# EAGLE design SparkFun_AST-CAN485 (EAGLE 7.7.0)
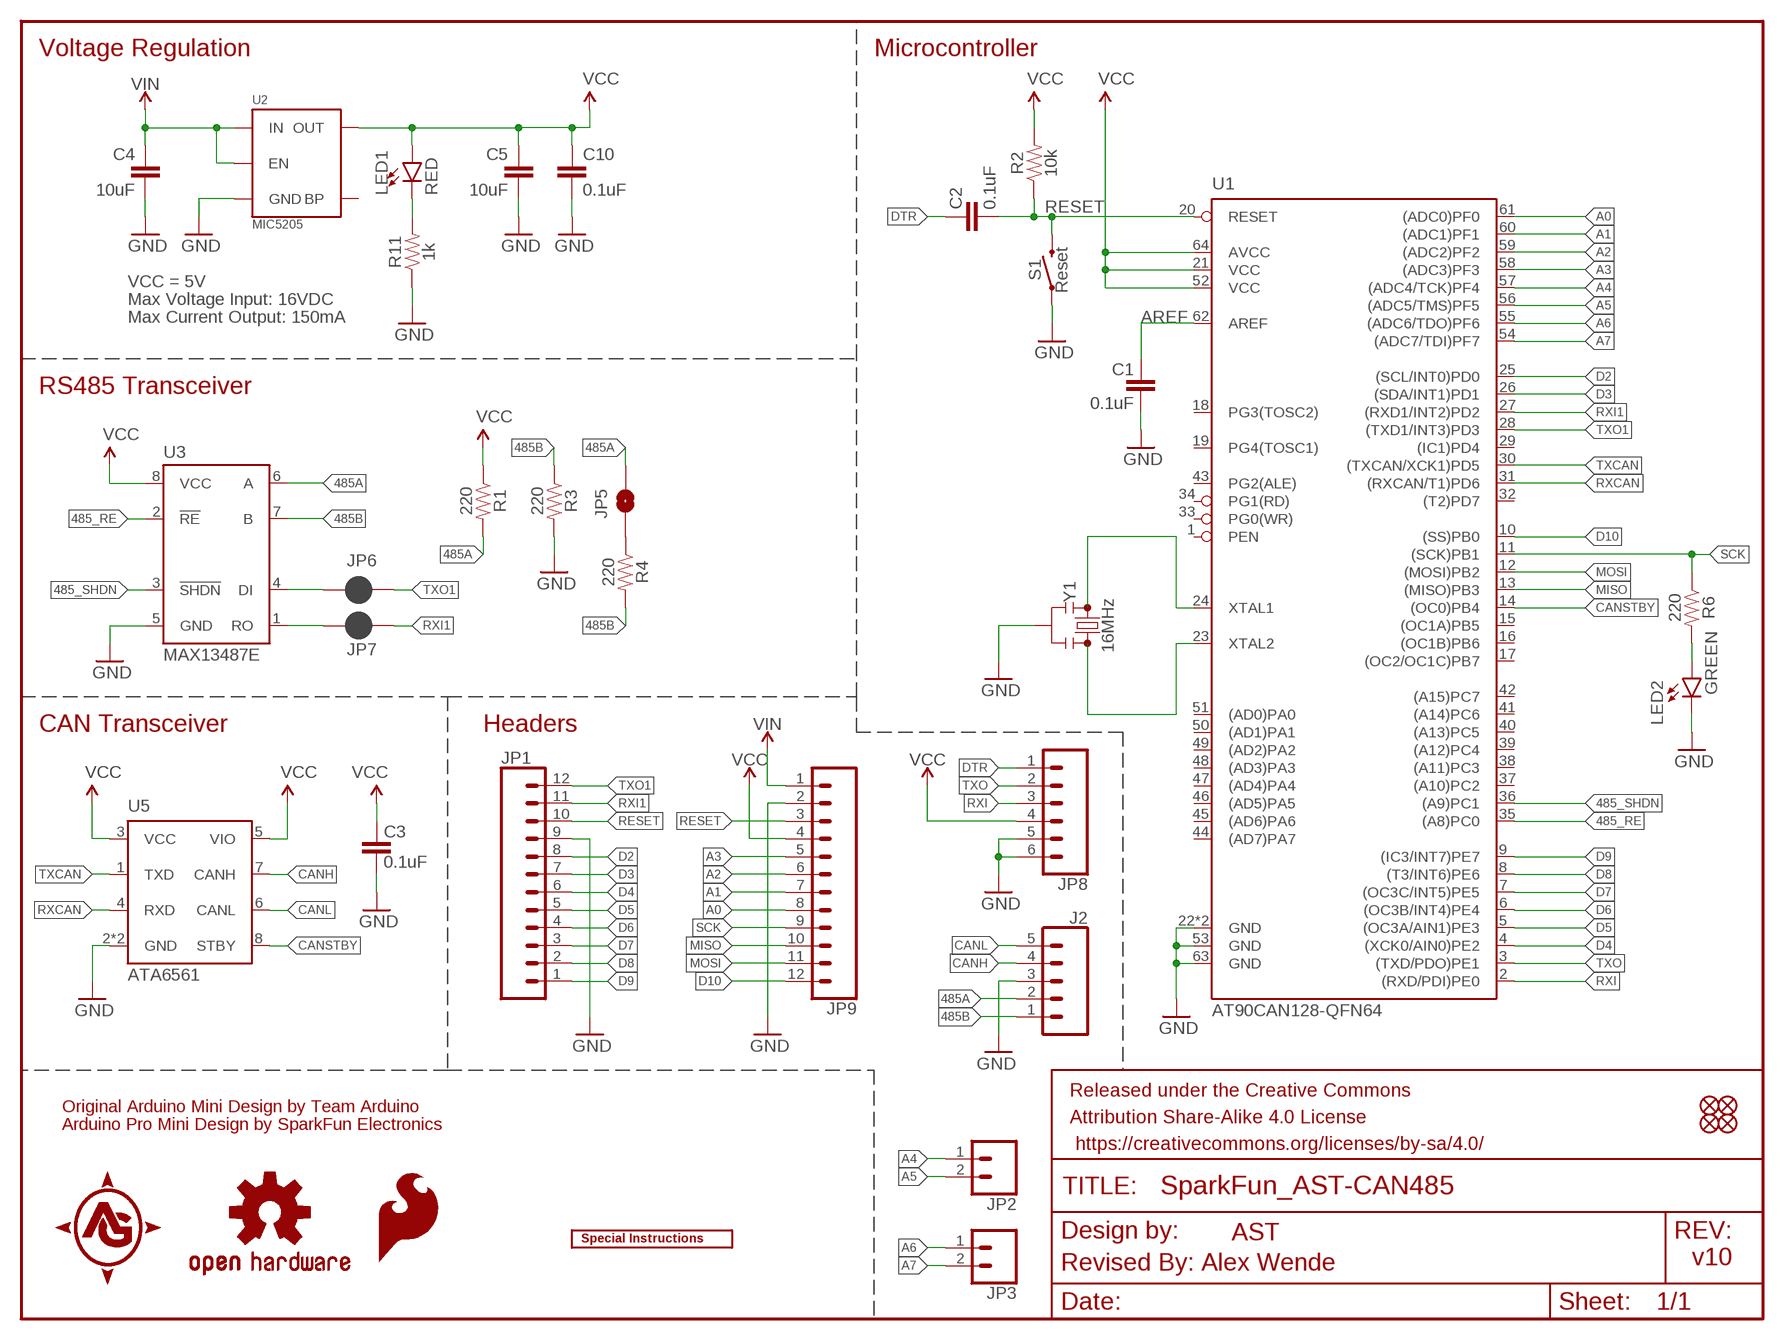
[diagram p0: schematic, sheet 1]

## Parts
C1  0.1uF  0.1UF-0402-16V-10%  [0402]
C2  0.1uF  0.1UF-0402-16V-10%  [0402]
C3  0.1uF  0.1UF-0402-16V-10%  [0402]
C4  10uF  10UF-1210-50V-20%  [1210]
C5  10uF  10UF-1210-50V-20%  [1210]
C10  0.1uF  0.1UF-0402-16V-10%  [0402]
FD1  FIDUCIALUFIDUCIAL  [FIDUCIAL-MICRO]
FD2  FIDUCIALUFIDUCIAL  [FIDUCIAL-MICRO]
FD3  FIDUCIALUFIDUCIAL  [FIDUCIAL-MICRO]
FD4  FIDUCIALUFIDUCIAL  [FIDUCIAL-MICRO]
FRAME1  FRAME-LETTER  [CREATIVE_COMMONS]
J2  CONN_05NO_SILK  [1X05_NO_SILK]
JP1  CONN_12NO_SILK  [1X12_NO_SILK]
JP2  CONN_021X02_NO_SILK  [1X02_NO_SILK]
JP3  CONN_021X02_NO_SILK  [1X02_NO_SILK]
JP5  JUMPER-PAD-2-NO  [PAD-JUMPER-2-NO_NO_SILK]
JP6  JUMPER-SMT_2_NC_PASTE_NO-SILK  [SMT-JUMPER_2_NC_PASTE_NO-SILK]
JP7  JUMPER-SMT_2_NC_PASTE_NO-SILK  [SMT-JUMPER_2_NC_PASTE_NO-SILK]
JP8  CONN_06NO_SILK_NO_POP  [1X06_NO_SILK]
JP9  CONN_12NO_SILK  [1X12_NO_SILK]
LED1  RED  LED-RED0603  [LED-0603]
LED2  GREEN  LED-GREEN0603  [LED-0603]
LOGO1  OSHW-LOGOMINI  [OSHW-LOGO-MINI]
LOGO2  SFE_LOGO_FLAME0.05_INCH  [SFE_LOGO_FLAME_.05]
R1  220  220OHM-0603-1/10W-1%  [0603]
R2  10k  10KOHM-0603-1/10W-1%  [0603]
R3  220  220OHM-0603-1/10W-1%  [0603]
R4  220  220OHM-0603-1/10W-1%  [0603]
R6  220  220OHM-0603-1/10W-1%  [0603]
R11  1k  1KOHM-0603-1/10W-1%  [0603]
S1  Reset  MOMENTARY-SWITCH-SPST-SMD-4.6X2.8MM  [TACTILE_SWITCH_SMD_4.6X2.8MM]
U1  AT90CAN128-QFN64  [QFN-64]
U2  MIC5205  [SOT23-5]
U3  MAX13487E  [SO08]
U5  ATA6561  [DFN8]
U$1  SPECIAL_INSTRUCTIONS-ORDERING  [ORDERING_INSTRUCTIONS]
Y1  16MHz  RESONATOR-16MHZSMD_3.2X1.3_SLIM  [RESONATOR-SMD-3.2X1.3(SLIM)]

## Nets
485_RE: U1.35((A8)PC0) U3.2(!RE)
485_SHDN: U1.36((A9)PC1) U3.3(!SHDN)
485A: J2.2 JP5.2 R1.2 U3.6(A)
485B: J2.1 R3.1 R4.2 U3.7(B)
A0: JP9.8 U1.61((ADC0)PF0)
A1: JP9.7 U1.60((ADC1)PF1)
A2: JP9.6 U1.59((ADC2)PF2)
A3: JP9.5 U1.58((ADC3)PF3)
A4: JP2.1 U1.57((ADC4/TCK)PF4)
A5: JP2.2 U1.56((ADC5/TMS)PF5)
A6: JP3.1 U1.55((ADC6/TDO)PF6)
A7: JP3.2 U1.54((ADC7/TDI)PF7)
AREF: C1.2 U1.62(AREF)
CANH: J2.4 U5.7(CANH)
CANL: J2.5 U5.6(CANL)
CANSTBY: U1.14((OC0)PB4) U5.8(STBY)
D2: JP1.8 U1.25((SCL/INT0)PD0)
D3: JP1.7 U1.26((SDA/INT1)PD1)
D4: JP1.6 U1.4((XCK0/AIN0)PE2)
D5: JP1.5 U1.5((OC3A/AIN1)PE3)
D6: JP1.4 U1.6((OC3B/INT4)PE4)
D7: JP1.3 U1.7((OC3C/INT5)PE5)
D8: JP1.2 U1.8((T3/INT6)PE6)
D9: JP1.1 U1.9((IC3/INT7)PE7)
D10: JP9.12 U1.10((SS)PB0)
DTR: C2.2 JP8.1
GND [vcc]: C1.1 C3.1 C4.2 C5.2 C10.2 J2.3 JP1.9 JP8.5 JP8.6 JP9.2 LED2.C R3.2 R11.1 S1.1 S1.2 U1.22(GND) U1.53(GND) U1.63(GND) U1.65(GND) U2.2(GND) U3.5(GND) U5.2(GND) U5.9(GND) Y1.2
MISO: JP9.10 U1.13((MISO)PB3)
MOSI: JP9.11 U1.12((MOSI)PB2)
N$1: U1.23(XTAL2) Y1.3
N$2: U1.24(XTAL1) Y1.1
N$3: JP5.1 R4.1
N$4: LED1.C R11.2
N$5: JP6.2 U3.4(DI)
N$6: JP7.2 U3.1(RO)
N$7: LED2.A R6.2
RESET: C2.1 JP1.10 JP9.3 R2.1 S1.3 S1.4 U1.20(RESET)
RXCAN: U1.31((RXCAN/T1)PD6) U5.4(RXD)
RXI: JP8.3 U1.2((RXD/PDI)PE0)
RXI1: JP1.11 JP7.1 U1.27((RXD1/INT2)PD2)
SCK: JP9.9 R6.1 U1.11((SCK)PB1)
TXCAN: U1.30((TXCAN/XCK1)PD5) U5.1(TXD)
TXO: JP8.2 U1.3((TXD/PDO)PE1)
TXO1: JP1.12 JP6.1 U1.28((TXD1/INT3)PD3)
VCC: C3.2 C5.1 C10.1 JP8.4 JP9.4 LED1.A R1.1 R2.2 U1.21(VCC) U1.52(VCC) U1.64(AVCC) U2.5(OUT) U3.8(VCC) U5.3(VCC) U5.5(VIO)
VIN [vcc]: C4.1 JP9.1 U2.1(IN) U2.3(EN)
Unconnected: U1.1(PEN) U1.15((OC1A)PB5) U1.16((OC1B)PB6) U1.17((OC2/OC1C)PB7) U1.18(PG3(TOSC2)) U1.19(PG4(TOSC1)) U1.29((IC1)PD4) U1.32((T2)PD7) U1.33(PG0(WR)) U1.34(PG1(RD)) U1.37((A10)PC2) U1.38((A11)PC3) U1.39((A12)PC4) U1.40((A13)PC5) U1.41((A14)PC6) U1.42((A15)PC7) U1.43(PG2(ALE)) U1.44((AD7)PA7) U1.45((AD6)PA6) U1.46((AD5)PA5) U1.47((AD4)PA4) U1.48((AD3)PA3) U1.49((AD2)PA2) U1.50((AD1)PA1) U1.51((AD0)PA0) U2.4(BP)

## Notes on the sheet
- Voltage Regulation | Microcontroller
- VCC = 5V
- Max Voltage Input: 16VDC
- Max Current Output: 150mA
- RS485 Transceiver
- CAN Transceiver | Headers
- Original Arduino Mini Design by Team Arduino
- Arduino Pro Mini Design by SparkFun Electronics
- AST
- Revised By: Alex Wende | v10

## Library data of the parts
C1-C3 C10 = SparkFun-Capacitors:0.1UF: 0.1µF ceramic capacitors A capacitor is a passive two-terminal electrical component used to store electrical energy temporarily in an electric field.; PROD_ID: CAP-12416
C4 C5 = SparkFun-Capacitors:10UF: 10.0µF ceramic capacitors A capacitor is a passive two-terminal electrical component used to store electrical energy temporarily in an electric field.; PROD_ID: CAP-09824
FD1-FD4 = SparkFun-Aesthetics:FIDUCIAL: Fiducial Alignment Points Point-of-reference for pick-and-place machines and other optical instruments.
FRAME1 = SparkFun-Aesthetics:FRAME-LETTER: Schematic Frame - Letter Standard 8.5x11 US Letter frame
J2 = SparkFun-Connectors:CONN_05: Multi connection point. Often used as Generic Header-pin footprint for 0.1 inch spaced/style header connections On any of the 0.1 inch spaced packages, you can populate with these: Break Away Headers - Straight <https://www.sparkfun.com/products/116> (PRT-00116) Break Away Male Headers - Right Angle <https://www.sparkfun.com/products/553> (PRT-00553) Female Headers <https://www.sparkfun.com/products/115> (PRT-00115) Break Away Headers - Machine Pin <https://www.sparkfun.com/products/117> (PRT-00117) Break Away Female Headers - Swiss Machine Pin <https://www.sparkfun.com/products/743> (PRT-00743) For SCREWTERMINALS and SPRING TERMINALS visit here: Screw Terimnals on SparkFun.com <https://www.sparkfun.com/search/results?term=Screw+Terminals> (5mm/3.5mm/2.54mm spacing) This device is also useful as a general connection point to wire up your design to another part of your project. Our various solder wires solder well into these plated through hole pads. Hook-Up Wire - Assortment (Stranded, 22 AWG) <https://www.sparkfun.com/products/11375> (PRT-11375) Hook-Up Wire - Assortment (Solid Core, 22 AWG) <https://www.sparkfun.com/products/11367> (PRT-11367) View the entire wire category on our website here <https://www.sparkfun.com/categories/141> Special notes: Molex polarized connector foot print use with SKU : PRT-08231 with associated crimp pins and housings. 1MM SMD Version SKU: PRT-10208
JP1 JP9 = SparkFun-Connectors:CONN_12: Multi connection point. Often used as Generic Header-pin footprint for 0.1 inch spaced/style header connections On any of the 0.1 inch spaced packages, you can populate with these: Break Away Headers - Straight <https://www.sparkfun.com/products/116> (PRT-00116) Break Away Male Headers - Right Angle <https://www.sparkfun.com/products/553> (PRT-00553) Female Headers <https://www.sparkfun.com/products/115> (PRT-00115) Break Away Headers - Machine Pin <https://www.sparkfun.com/products/117> (PRT-00117) Break Away Female Headers - Swiss Machine Pin <https://www.sparkfun.com/products/743> (PRT-00743) For SCREWTERMINALS and SPRING TERMINALS visit here: Screw Terimnals on SparkFun.com <https://www.sparkfun.com/search/results?term=Screw+Terminals> (5mm/3.5mm/2.54mm spacing) This device is also useful as a general connection point to wire up your design to another part of your project. Our various solder wires solder well into these plated through hole pads. Hook-Up Wire - Assortment (Stranded, 22 AWG) <https://www.sparkfun.com/products/11375> (PRT-11375) Hook-Up Wire - Assortment (Solid Core, 22 AWG) <https://www.sparkfun.com/products/11367> (PRT-11367) View the entire wire category on our website here <https://www.sparkfun.com/categories/141> Special notes: Molex polarized connector foot print use with SKU : PRT-08231 with associated crimp pins and housings. 1MM SMD Version SKU: PRT-10208 NOTES ON THE VARIANTS LOCK and LOCK_LONGPADS... This footprint was designed to help hold the alignment of a through-hole component (i.e. 6-pin header) while soldering it into place. You may notice that each hole has been shifted either up or down by 0.005 of an inch from it's more standard position (which is a perfectly straight line). This slight alteration caused the pins (the squares in the middle) to touch the edges of the holes. Because they are alternating, it causes a "brace" to hold the component in place. 0.005 has proven to be the perfect amount of "off-center" position when using our standard breakaway headers. Although looks a little odd when you look at the bare footprint, once you have a header in there, the alteration is very hard to notice. Also,if you push a header all the way into place, it is covered up entirely on the bottom side.
JP2 JP3 = SparkFun-Connectors:CONN_02: Multi connection point. Often used as Generic Header-pin footprint for 0.1 inch spaced/style header connections On any of the 0.1 inch spaced packages, you can populate with these: Break Away Headers - Straight <https://www.sparkfun.com/products/116> (PRT-00116) Break Away Male Headers - Right Angle <https://www.sparkfun.com/products/553> (PRT-00553) Female Headers <https://www.sparkfun.com/products/115> (PRT-00115) Break Away Headers - Machine Pin <https://www.sparkfun.com/products/117> (PRT-00117) Break Away Female Headers - Swiss Machine Pin <https://www.sparkfun.com/products/743> (PRT-00743) For SCREWTERMINALS and SPRING TERMINALS visit here: Screw Terimnals on SparkFun.com <https://www.sparkfun.com/search/results?term=Screw+Terminals> (5mm/3.5mm/2.54mm spacing) This device is also useful as a general connection point to wire up your design to another part of your project. Our various solder wires solder well into these plated through hole pads. Hook-Up Wire - Assortment (Stranded, 22 AWG) <https://www.sparkfun.com/products/11375> (PRT-11375) Hook-Up Wire - Assortment (Solid Core, 22 AWG) <https://www.sparkfun.com/products/11367> (PRT-11367) View the entire wire category on our website here <https://www.sparkfun.com/categories/141> Special notes: Molex polarized connector foot print use with: PRT-08233 with associated crimp pins and housings. 2.54_SCREWTERM for use with PRT-10571. 3.5mm Screw Terminal footprints for PRT-08084 5mm Screw Terminal footprints for use with PRT-08432
JP5 = SparkFun-Passives:JUMPER-PAD-2-NO
JP6 JP7 = SparkFun-Jumpers:JUMPER-SMT_2_NC_PASTE: Normally closed solder jumper This jumper has an aperture in the stencil to allow solder paste to bridge the split in the wire so it's normally closed (NC). Wick off the solder to open the connection. Reapply solder to reclose the connection.
JP8 = SparkFun-Connectors:CONN_06: Multi connection point. Often used as Generic Header-pin footprint for 0.1 inch spaced/style header connections On any of the 0.1 inch spaced packages, you can populate with these: Break Away Headers - Straight <https://www.sparkfun.com/products/116> (PRT-00116) Break Away Male Headers - Right Angle <https://www.sparkfun.com/products/553> (PRT-00553) Female Headers <https://www.sparkfun.com/products/115> (PRT-00115) Break Away Headers - Machine Pin <https://www.sparkfun.com/products/117> (PRT-00117) Break Away Female Headers - Swiss Machine Pin <https://www.sparkfun.com/products/743> (PRT-00743) Arduino Stackable Header - 6 Pin <https://www.sparkfun.com/products/9280> (PRT-09280) For SCREWTERMINALS and SPRING TERMINALS visit here: Screw Terimnals on SparkFun.com <https://www.sparkfun.com/search/results?term=Screw+Terminals> (5mm/3.5mm/2.54mm spacing) This device is also useful as a general connection point to wire up your design to another part of your project. Our various solder wires solder well into these plated through hole pads. Hook-Up Wire - Assortment (Stranded, 22 AWG) <https://www.sparkfun.com/products/11375> (PRT-11375) Hook-Up Wire - Assortment (Solid Core, 22 AWG) <https://www.sparkfun.com/products/11367> (PRT-11367) View the entire wire category on our website here <https://www.sparkfun.com/categories/141>
LED1 = SparkFun-LED:LED-RED: Red SMD LED Used in manufacturing of most products at SparkFun Packages: 0603 - SMD 0603 package [Product Link] <http://docs.avagotech.com/docs/AV02-0551EN> 0603 SMART - SMD 0603 SMART package ( more efficient and expensive)[Product Link] <http://www.osram-os.com/Graphics/XPic2/00077099_0.pdf> 1206 - SMD1206 package [Product Link] <https://www.sparkfun.com/datasheets/DevTools/LilyPad/Q150OVS4.pdff> SparkFun Products: Pro Mini 328 -5V <https://www.sparkfun.com/products/821> RedBoard <https://www.sparkfun.com/products/12757> IOIO-OTG <https://www.sparkfun.com/products/13613>; PROD_ID: DIO-00819
LED2 = SparkFun-LED:LED-GREEN: Green SMD LED Used in manufacturing of various products at SparkFun Packages: 0603 - SMD 0603 package [Product Link] <http://www.futureelectronics.com/en/technologies/semiconductors/optoelectronics/leds/Pages/9894312-LTST-C190GKT.aspx?CrossPart=HSMG-C190&IM=0> LilyPad 1206 - SMD1206 LilyPad package [Product Link] <http://www.futureelectronics.com/en/Technologies/Product.aspx?ProductID=IN150NGHARVATEKCORPORATION2049943&IM=0> 1206 - SMD1206 package [Product Link] <http://www.futureelectronics.com/en/technologies/semiconductors/optoelectronics/leds/Pages/8315665-LTST-C150KGKT.aspx?IM=0> 1206 Bottom Mount -SMD 1206 Bottom Mount [Product Link] <http://www.digikey.com/product-detail/en/lite-on-inc/LTST-C230KGKT/160-1456-1-ND/386854> SparkFun Products: Pro Mini 328 -5V <https://www.sparkfun.com/products/821> RedBoard <https://www.sparkfun.com/products/12757> MP3 Trigger <https://www.sparkfun.com/products/13720> Makey Makey <https://www.sparkfun.com/products/11076>; PROD_ID: DIO-00821
LOGO1 = SparkFun-Aesthetics:OSHW-LOGO: Open-Source Hardware (OSHW) Logo This logo indicates the piece of hardware it is found on incorporates a OSHW license and/or adheres to the definition of open source hardware found here: http://freedomdefined.org/OSHW
LOGO2 = SparkFun-Aesthetics:SFE_LOGO_FLAME: SparkFun Flame Logo This is the SparkFun flame logo. The logo on the schematic will always be the same size; the package variant is the height of the flame. Default layer for the logo on the board is tSilk.
R1 R3 R4 R6 = SparkFun-Resistors:220OHM: 220Ω resistor A resistor is a passive two-terminal electrical component that implements electrical resistance as a circuit element. Resistors act to reduce current flow, and, at the same time, act to lower voltage levels within circuits. - Wikipedia; PROD_ID: RES-07861
R2 = SparkFun-Resistors:10KOHM: 10kΩ resistor A resistor is a passive two-terminal electrical component that implements electrical resistance as a circuit element. Resistors act to reduce current flow, and, at the same time, act to lower voltage levels within circuits. - Wikipedia; PROD_ID: RES-00824
R11 = SparkFun-Resistors:1KOHM: 1kΩ resistor A resistor is a passive two-terminal electrical component that implements electrical resistance as a circuit element. Resistors act to reduce current flow, and, at the same time, act to lower voltage levels within circuits. - Wikipedia; PROD_ID: RES-07856
S1 = SparkFun-Switches:MOMENTARY-SWITCH-SPST: Momentary Switch (Pushbutton) - SPST Normally-open (NO) SPST momentary switches (buttons, pushbuttons). Variants PTH-12MM - 12mm square, through-hole Momentary Pushbutton Switch - 12mm Square <https://www.sparkfun.com/products/9190> (COM-09190) PTH-6.0MM, PTH-6.0MM-KIT - 6.0mm square, through-hole Mini Pushbutton Switch <https://www.sparkfun.com/products/97> (COM-00097) KIT package intended for soldering kit's - only one side of pads' copper is exposed. PTH-RIGHT-ANGLE-KIT - Right-angle, through-hole Right Angle Tactile Button <https://www.sparkfun.com/products/10791> - Used on SparkFun BigTime Watch Kit <https://www.sparkfun.com/products/11734> SMD-12MM - 12mm square, surface-mount Tactile Button - SMD (12mm) <https://www.sparkfun.com/products/12993> (COM-12993) Used on SparkFun PicoBoard <https://www.sparkfun.com/products/11888> SMD-4.5MM - 4.5mm Square Trackball Switch Used on SparkFun Blackberry Trackballer Breakout <https://www.sparkfun.com/products/13169> SMD-4.6MMX2.8MM - 4.60mm x 2.80mm, surface mount Used on SparkFun SAMD21 Mini Breakout <https://www.sparkfun.com/products/13664> SMD-5.2MM, SMD-5.2-REDUNDANT - 5.2mm square, surface-mount Mini Pushbutton Switch - SMD <https://www.sparkfun.com/products/8720> (COM-08720) Used on Arduino Pro Mini <https://www.sparkfun.com/products/11114> REDUNDANT package connects both switch circuits together SMD-6.0X3.5MM - 6.0 x 3.5mm, surface mount Momentary Reset Switch SMD <https://www.sparkfun.com/products/8229> (COM-08229) SMD-6.2MM-TALL - 6.2mm square, surface mount Tactile Button - SMD (6mm) <https://www.sparkfun.com/products/12992> Used on SparkFun Digital Sandbox <https://www.sparkfun.com/products/12651> SMD-RIGHT-ANGLE - Right-angle, surface mount Used on SparkFun Block for Intel® Edison - Arduino <https://www.sparkfun.com/products/13036>; PROD_ID: SWCH-13065
U1 = SparkFun-IC-Microcontroller:AT90CAN128; PROD_ID: IC-13822
U2 = SparkFun-IC-Power:MIC5205; PROD_ID: VREG-00823
U3 = SparkFun-IC-Comms:MAX13487E; PROD_ID: IC-13823
U5 = SparkFun-IC-Comms:ATA6561; PROD_ID: IC-13837
U$1 = SparkFun-Aesthetics:SPECIAL_INSTRUCTIONS: Special Ordering/Production Instructions Alert Symbol for special PCB ordering instructions or unique production process warnings. Ordering Instructions Production Instructions Types of information that should be added to box: Copper weight Soldermask color Silk color PCB thickness Number of layers PCB Standard: 1.6mm FR4 1 oz copper immersion silver plating red soldermask white silkscreen Types of information that should be added to box: Special wash requirements Depaneling instructions Humidification Glue curing Default text settings: 0.07 inch 9% ratio 50% line distance
Y1 = SparkFun-Clocks:RESONATOR-16MHZ: 16MHz Resonator Digikey Example <http://www.digikey.com/product-detail/en/murata-electronics-north-america/CSTCE16M0V53-R0/490-1198-1-ND/584635> Frequency: 16MHz Frequency Stability: ±0.3% Frequency Tolerance: ±0.5% Capacitance: 15pF SparkFun Products SparkFun OpenLog <https://www.sparkfun.com/products/13712> SparkFun MicroView - OLED Arduino Module <https://www.sparkfun.com/products/12923>; PROD_ID: XTAL-08900

## Net classes
0 default: width 0.203 mm
1 vcc: width 0.254 mm

## Board
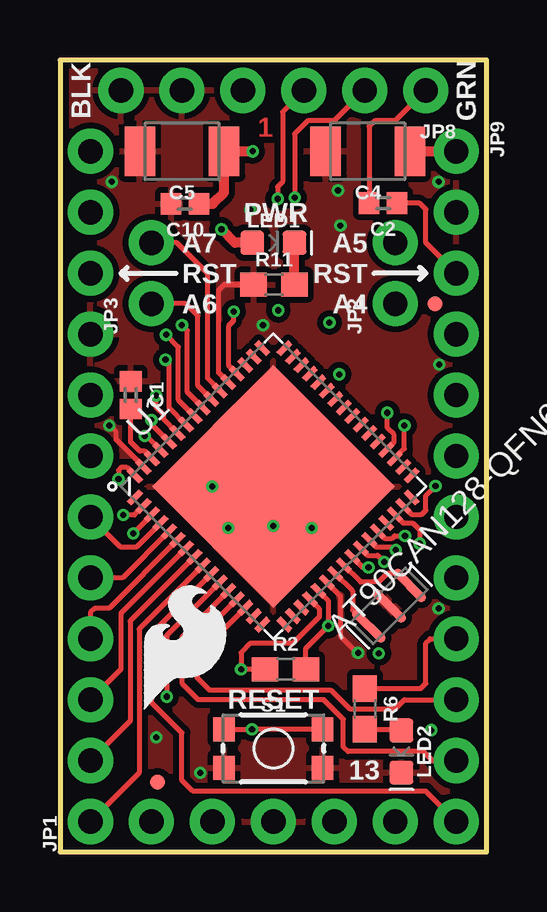
[diagram p1: board, top side]
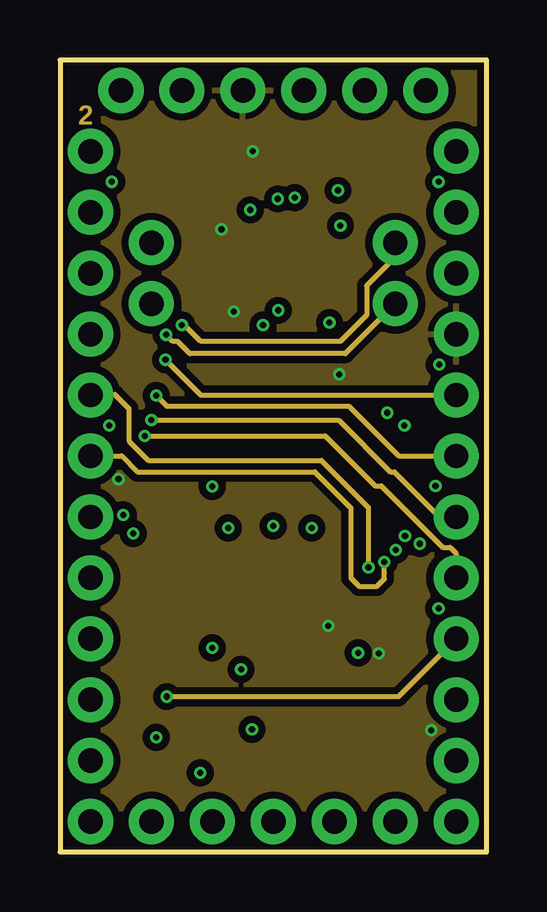
[diagram p2: board, inner layer Route2]
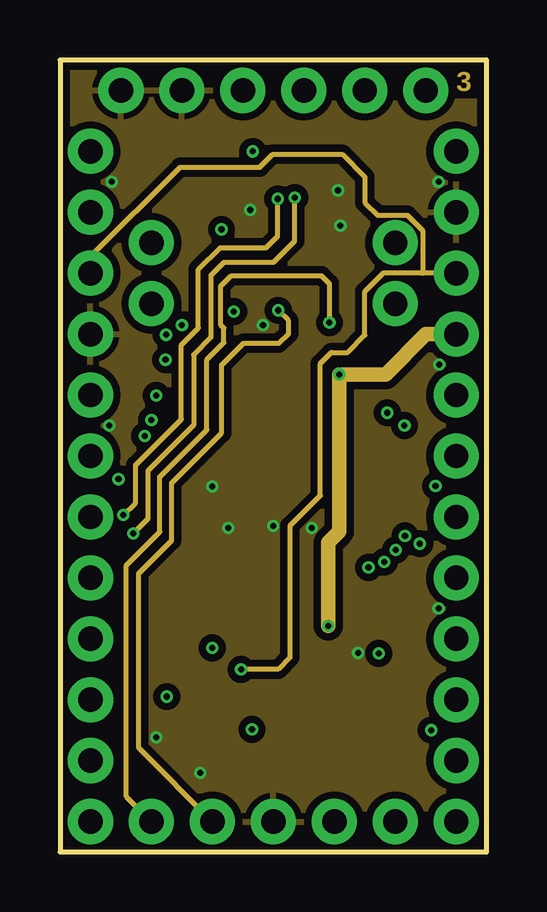
[diagram p3: board, inner layer Route15]
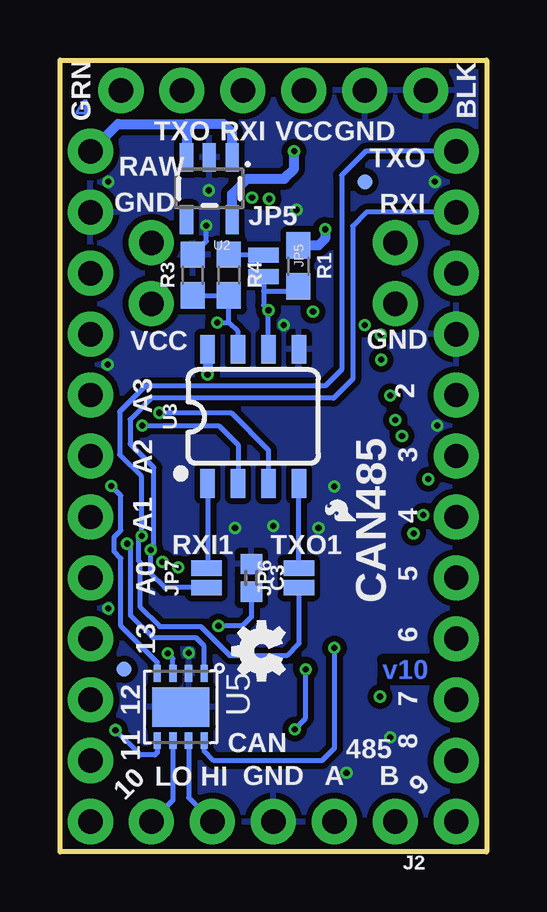
[diagram p4: board, bottom side, seen from below]

Size 17.78 x 33.02 mm. Coordinates in mm from the lower left corner, seen from the top.
Outline: 0,0 17.78,0 17.78,33.02 0,33.02 0,0
Copper layers (1*2*15*16): Top 0.035559375mm / dielectric 0.47751875mm / Route2 0.035559375mm / dielectric 0.47751875mm / Route15 0.035559375mm / dielectric 0.47751875mm / Bottom 0.035559375mm
Design rules "SparkFun-4-layer-FAB-LIMIT": minimum track width 4mil, minimum drill 6mil, track to track 5mil, track to pad 5mil, pad to pad 5mil, via to via 5mil, smd to smd 5mil, copper to edge 4mil, drill to drill 4mil, minimum pad ring 5mil, minimum via ring 5mil, stop-mask expansion 4mil, vias tented up to drill 25mil, thermal gap 10mil
tRestrict: 3 lines

### Footprints (pad centres in the part's own frame; a part is rotated, then mirrored left to right if it is on the bottom)
0402 = smd 0.85 x 0.9: 1 -0.58,0; 2 0.58,0
1210 = smd 1.27 x 2.06: 1 -1.755,0; 2 1.755,0
FIDUCIAL-MICRO = smd 0.635 x 0.635: 1 0,0
1X05_NO_SILK = drill 1.016 pad 1.88: 1 0,0; 2 2.54,0; 3 5.08,0; 4 7.62,0; 5 10.16,0
1X12_NO_SILK = drill 1.016 pad 1.88: 1 0,0; 2 2.54,0; 3 5.08,0; 4 7.62,0; 5 10.16,0; 6 12.7,0; 7 15.24,0; 8 17.78,0; 9 20.32,0; 10 22.86,0; 11 25.4,0; 12 27.94,0
1X02_NO_SILK = drill 1.016 pad 1.88: 1 0,0; 2 2.54,0
PAD-JUMPER-2-NO_NO_SILK = smd 0.635 x 1.27: 1 -0.45,0; 2 0.45,0
SMT-JUMPER_2_NC_PASTE_NO-SILK = smd 0.635 x 1.27: 1 -0.406,0; 2 0.406,0
1X06_NO_SILK = drill 1.016 pad 1.88: 1 0,0; 2 2.54,0; 3 5.08,0; 4 7.62,0; 5 10.16,0; 6 12.7,0
LED-0603 = smd 1 x 1: A -0.877,0; C 0.877,0
0603 = smd 1.1 x 1: 1 -0.85,0; 2 0.85,0
TACTILE_SWITCH_SMD_4.6X2.8MM = smd 0.9 x 1: 1 -2.05,-0.8; 2 2.05,-0.8; 3 2.05,0.8; 4 -2.05,0.8
QFN-64 = smd 0.7 x 0.25: 1 -4.4,3.75; 2 -4.4,3.25; 3 -4.4,2.75; 4 -4.4,2.25; 5 -4.4,1.75; 6 -4.4,1.25; 7 -4.4,0.75; 8 -4.4,0.25; 9 -4.4,-0.25; 10 -4.4,-0.75; 11 -4.4,-1.25; 12 -4.4,-1.75; 13 -4.4,-2.25; 14 -4.4,-2.75; 15 -4.4,-3.25; 16 -4.4,-3.75; 33 4.4,-3.75; 34 4.4,-3.25; 35 4.4,-2.75; 36 4.4,-2.25; 37 4.4,-1.75; 38 4.4,-1.25; 39 4.4,-0.75; 40 4.4,-0.25; 41 4.4,0.25; 42 4.4,0.75; 43 4.4,1.25; 44 4.4,1.75; 45 4.4,2.25; 46 4.4,2.75; 47 4.4,3.25; 48 4.4,3.75 | smd 0.25 x 0.7: 17 -3.75,-4.4; 18 -3.25,-4.4; 19 -2.75,-4.4; 20 -2.25,-4.4; 21 -1.75,-4.4; 22 -1.25,-4.4; 23 -0.75,-4.4; 24 -0.25,-4.4; 25 0.25,-4.4; 26 0.75,-4.4; 27 1.25,-4.4; 28 1.75,-4.4; 29 2.25,-4.4; 30 2.75,-4.4; 31 3.25,-4.4; 32 3.75,-4.4; 49 3.75,4.4; 50 3.25,4.4; 51 2.75,4.4; 52 2.25,4.4; 53 1.75,4.4; 54 1.25,4.4; 55 0.75,4.4; 56 0.25,4.4; 57 -0.25,4.4; 58 -0.75,4.4; 59 -1.25,4.4; 60 -1.75,4.4; 61 -2.25,4.4; 62 -2.75,4.4; 63 -3.25,4.4; 64 -3.75,4.4; 66 -0.25,4.4 | smd 7.15 x 7.15: 65 0,0
SOT23-5 = smd 0.55 x 1.2: 1 -0.95,-1.3; 2 0,-1.3; 3 0.95,-1.3; 4 0.95,1.3; 5 -0.95,1.3
SO08 = smd 0.6 x 1.2: 1 -1.905,-2.8; 2 -0.635,-2.8; 3 0.635,-2.8; 4 1.905,-2.8; 5 1.905,2.8; 6 0.635,2.8; 7 -0.635,2.8; 8 -1.905,2.8
DFN8 = smd 0.3 x 0.7: 1 -0.975,-1.4; 2 -0.325,-1.4; 3 0.325,-1.4; 4 0.975,-1.4; 5 0.975,1.4; 6 0.325,1.4; 7 -0.325,1.4; 8 -0.975,1.4 | smd 2.38 x 1.65: 9 0,0
RESONATOR-SMD-3.2X1.3(SLIM) = smd 0.4 x 1.8: 1 -1.2,0; 2 0,0; 3 1.2,0

### Placement (x,y rotation side)
C1  2.95,19.05 270 top
C2  13.46,27.05 180 top
C3  9.8,11.43 270 bottom
C4  12.83,29.21 180 top
C5  5.08,29.21 180 top
C10  5.21,27.03 180 top
FD1  4.06,2.92 0 top
FD2  15.62,22.86 0 top
FD3  5.08,27.94 0 bottom
FD4  15.11,7.62 0 bottom
FRAME1  -22.86,-15.24 0 top  (outside the outline)
J2  3.81,1.27 180 bottom
JP1  1.27,1.27 90 top
JP2  13.97,22.86 90 top
JP3  3.81,22.86 90 top
JP5  9.3,24.43 270 bottom
JP6  7.82,11.43 90 bottom
JP7  11.68,11.43 90 bottom
JP8  15.24,31.75 180 top
JP9  16.51,29.21 270 top
LED1  8.89,25.4 0 top
LED2  14.22,4.19 270 top
LOGO1  9.4,8.38 90 bottom
LOGO2  4.95,13.46 90 bottom
LOGO3  SFE_LOGO_FLAME0.05_INCH  [SFE_LOGO_FLAME_.2]  3.17,5.71 0 top
R1  7.85,24.43 270 bottom
R2  9.4,7.62 0 top
R3  12.24,24.05 90 bottom
R4  10.74,24.05 270 bottom
R6  12.7,5.97 270 top
R11  8.92,23.65 0 top
S1  8.89,4.32 0 top
U1  8.89,15.24 45 top
U2  11.56,27.66 180 bottom
U3  9.73,18.16 0 bottom
U5  12.75,6.05 180 bottom
U$1  -43.18,-19.05 0 top  (outside the outline)
Y1  13.72,10.26 225 top

### Tracks (layer width: path | path; a pad name or v marks a point on that pad's centre or on a via)
485_RE  (via drill 0.25)
  Top 0.203: U1.35 14.35,16.81 v14.35,17.78
  Bottom 0.203: v14.35,17.78 11.17,17.78 10.36,16.98 U3.2
485_SHDN  (via drill 0.25)
  Top 0.203: U1.36 13.92,17.09 13.92,17.4 13.64,17.68 v13.64,18.31
  Bottom 0.203: v13.64,18.31 10.65,18.31 9.09,16.75 U3.3
485A  (via drill 0.25)
  Route15 0.203: v9.09,22.58 9.53,22.15 9.53,21.61 9.12,21.21 7.65,21.21 6.76,20.32 6.73,20.32 6.73,17.48 4.65,15.39 4.65,12.98 3.28,11.61 3.28,4.34 J2.2
  Bottom 0.203: JP5.2 9.3,23.37 | 9.3,23.37 9.3,22.78 v9.09,22.58 U3.6 | R1.2 8.06,23.37 9.3,23.37
485B  (via drill 0.25)
  Route15 0.203: v11.23,22.07 11.23,23.69 10.89,24.03 7.14,24.03 6.71,23.59 6.71,21.97 6.83,21.84 6.83,21.23 6.12,20.52 6.12,17.6 4.19,15.67 4.17,15.67 4.17,13.35 2.77,11.95 2.77,2.31 J2.1
  Bottom 0.203: R3.1 R4.2 10.74,22.07 | U3.7 10.36,21.69 10.74,22.07 | v11.23,22.07 10.74,22.07
A0  (via drill 0.25)
  Top 0.203: U1.61 3.6,17.35 v3.53,17.35
  Route2 0.203: JP9.8 16.51,12.45 16.26,12.7 15.95,12.7 13.39,15.27 13.13,15.27 11.05,17.35 v3.53,17.35
A1  (via drill 0.25)
  Top 0.203: U1.60 3.81,17.84 v3.81,18.01
  Route2 0.203: v3.81,18.01 11.61,18.01 13.77,15.85 13.93,15.85 15.81,13.97 JP9.7
A2  (via drill 0.25)
  Top 0.203: U1.59 4.32,18.04 4.32,18.21 4.01,18.52 v4.01,19.02
  Route2 0.203: v4.01,19.02 4.45,18.59 12.04,18.59 14.12,16.51 JP9.6
A3  (via drill 0.25)
  Top 0.203: U1.58 4.55,18.52 4.55,20.37 v4.39,20.52
  Route2 0.203: v4.39,20.52 5.87,19.05 JP9.5
A4  (via drill 0.25)
  Top 0.203: U1.57 4.93,18.85 4.93,21.06 v4.42,21.57
  Route2 0.203: JP2.1 11.89,20.78 5.41,20.78 4.9,21.29 4.7,21.29 v4.42,21.57
A5  (via drill 0.25)
  Top 0.203: U1.56 5.31,19.18 5.31,21.74 v5.08,21.97
  Route2 0.203: JP2.2 13.97,24.8 12.78,23.6 12.78,22.38 11.68,21.29 5.87,21.29 5.18,21.97 v5.08,21.97
A6
  Top 0.203: U1.55 5.74,19.45 5.74,22.36 5.24,22.86 JP3.1
A7
  Top 0.203: U1.54 6.15,19.75 6.15,24.11 4.86,25.4 JP3.2
AREF
  Top 0.203: U1.62 3.53,16.71 3.32,16.71 2.95,17.09 C1.2
CANH
  Bottom 0.203: U5.7 12.43,2.27 J2.4
CANL
  Bottom 0.203: U5.6 13.08,2.16 J2.5
CANSTBY  (via drill 0.25)
  Top 0.203: U1.14 6.35,8.81 v6.35,8.51
  Bottom 0.203: v6.35,8.51 6.35,4.33 6.87,3.81 11.36,3.81 11.78,4.22 U5.8
D2  (via drill 0.25)
  Top 0.203: U1.25 12.62,11.86 v12.85,11.86
  Route2 0.203: JP1.8 1.27,19.07 2.29,19.07 2.87,18.5 2.87,17.14 3.68,16.33 10.89,16.33 12.85,14.37 v12.85,11.86
D3  (via drill 0.25)
  Top 0.203: U1.26 12.82,12.37 13.23,12.37 v13.51,12.09
  Route2 0.203: 13.51,11.65 v13.51,12.09 13.51,11.38 13.2,11.07 12.46,11.07 12.12,11.42 12.12,14.35 10.62,15.85 3.23,15.85 2.56,16.51 JP1.7
D4
  Top 0.203: U1.4 3.17,12.7 2.54,12.7 JP1.6
D5
  Top 0.203: U1.5 2.6,11.43 JP1.5
D6
  Top 0.203: U1.6 2.04,10.16 1.45,10.16 1.27,9.98 JP1.4
D7
  Top 0.203: U1.7 2.54,9.95 2.54,7.62 JP1.3
D8
  Top 0.203: U1.8 2.92,9.62 2.92,5.46 JP1.2
D9
  Top 0.203: U1.9 3.3,9.3 3.3,3.3 JP1.1
D10
  Top 0.203: U1.10 3.81,9.1 3.81,6.24 5.08,4.97 5.08,3 5.54,2.54 15.24,2.54 JP9.12
DTR
  Top 0.203: JP8.1 13.97,30.48 13.11,30.48 12.88,30.25 C2.2
GND  (via drill 0.25)
  Top 0.203: 11.56,10.8 U1.22 11.68,10.68 11.68,9.02 12.39,8.31 v12.42,8.31 | U1.63 2.34,17.2 2.34,17.5 v2.06,17.78 | U1.53 6.6,20 6.6,23.41 6.84,23.65
  Top 0.254: R11.1 6.84,23.65
  Bottom 0.203: R3.2 11.68,25.46 v11.68,26.11
  other vias: 15.77,10.16 5.84,3.3 8.46,21.97 4.01,4.78 15.8,20.32 11.58,27.58 7.92,26.77 15.77,27.94 2.16,27.94 10.49,13.51 8.89,13.59 7.01,13.51 6.35,15.24
  pour Top (isolate 0.254): 0,0 0,33.02 17.78,33.02 17.78,0
  pour Bottom (isolate 0.254): 0,0 17.78,0 17.78,33.02 0,33.02
  pour Route15 (isolate 0.305): 0,33.02 0,0 17.78,0 17.78,33.02
MISO
  Top 0.203: U1.13 5.71,8.88 5.71,7.26 6.22,6.76 11.28,6.76 12.07,5.97 13.97,5.97 14.35,6.35 JP9.10
MOSI
  Top 0.203: U1.12 5.08,8.96 5.08,7.03 5.76,6.35 11,6.35 11.81,5.54 11.81,4.37 11.99,4.19 15.14,4.19 15.52,3.81 JP9.11
N$1
  Top 0.203: U1.23 12.19,10.88 12.19,10.09 Y1.3
N$2
  Top 0.203: U1.24 12.52,11.25 13.28,11.25 13.66,11.63 14.02,11.63 14.54,11.11 Y1.1
N$3
  Bottom 0.203: R4.1 9.3,24.9 JP5.1
N$4
  Top 0.406: R11.2 LED1.C
N$5
  Bottom 0.203: JP6.2 U3.4
N$6
  Bottom 0.203: U3.1 11.63,11.89 JP7.2
N$7
  Top 0.203: R6.2 14.22,5.12 LED2.A
RESET  (via drill 0.25)
  Top 0.203: U1.20 10.79,10.15 10.79,9.79 9.69,8.69 7.91,8.69 7.54,8.32 v7.54,7.62 R2.1 | JP9.3 15.24,25.4 15.24,26.8 14.99,27.05 C2.1 | S1.4 v8,5.12 S1.3
  Route15 0.203: JP1.10 1.27,24.82 5,28.55 8.33,28.55 8.87,29.08 11.76,29.08 12.7,28.14 12.7,27.08 13.24,26.54 14.48,26.54 15.11,25.91 15.11,24.13 | JP9.3 15.11,24.13 | 15.11,24.13 13.46,24.13 12.7,23.37 12.7,21.55 11.98,20.83 11.3,20.83 10.85,20.37 10.85,14.86 9.58,13.59 9.58,8.11 9.09,7.62 v7.54,7.62
  Bottom 0.203: v8,5.12 7.54,5.58 v7.54,7.62
RXCAN  (via drill 0.25)
  Top 0.203: U1.31 14.65,14.07 15.06,14.07 15.24,14.25 15.24,14.86 v15.65,15.27
  Bottom 0.203: U5.4 13.73,7.91 15.24,9.43 15.24,12.24 15.53,12.53 15.53,13.13 15.24,13.41 15.24,14.86 v15.65,15.27
RXI  (via drill 0.25)
  Top 0.203: JP8.3 9.27,30.86 9.27,27.94 9.07,27.74 v9.07,27.23 | U1.2 3.1,14.05 v2.64,14.05
  Route15 0.203: v9.07,27.23 9.07,25.67 8.59,25.2 6.67,25.2 5.77,24.29 5.77,21.85 5.05,21.14 5.05,18.04 3.15,16.14 3.15,14.55 v2.64,14.05
RXI1  (via drill 0.25)
  Top 0.203: v13.99,12.6 13.89,12.7 13.2,12.7 U1.27
  Bottom 0.203: JP1.11 5.02,26.67 5.59,26.1 5.59,19.71 6.38,18.92 13.97,18.92 14.86,18.03 14.86,17.02 13.87,16.03 13.87,12.72 v13.99,12.6 13.99,11.6 13.42,11.02 JP7.1
SCK  (via drill 0.25)
  Top 0.203: U1.11 4.45,9.03 v4.45,6.48 | R6.1 15.03,6.82 15.24,7.03 15.24,8.71 15.42,8.89 JP9.9
  Route2 0.203: JP9.9 14.1,6.48 v4.45,6.48
TXCAN  (via drill 0.25)
  Top 0.203: U1.30 14.3,13.72 14.69,13.72 14.99,13.42 v14.99,12.85
  Bottom 0.203: v14.99,12.85 14.83,12.7 14.83,9.85 13.92,8.94 12.12,8.94 11.78,8.59 U5.1
TXO  (via drill 0.25)
  Top 0.203: JP8.2 11.43,30.48 10.32,30.48 9.78,29.94 v9.78,27.28 | U1.3 v3.05,13.29 v3.05,13.28
  Route15 0.203: v9.78,27.28 9.78,25.46 8.9,24.59 6.84,24.59 6.3,24.04 6.3,21.46 5.56,20.73 5.56,17.79 3.66,15.89 3.66,13.89 v3.05,13.28
TXO1  (via drill 0.25)
  Top 0.203: U1.28 13.52,13.08 13.84,13.08 13.95,13.18 v14.38,13.18
  Bottom 0.203: JP6.1 7.82,8.69 8.34,8.18 10.69,8.18 11.91,9.4 13.62,9.4 14.43,10.2 14.43,12.06 14.5,12.14 14.5,13.06 v14.38,13.18 14.38,15.65 15.29,16.56 15.29,18.36 14.22,19.43 6.72,19.43 6.04,20.11 6.04,28.21 5.04,29.21 JP1.12
VCC  (via drill 0.25)
  Top 0.203: U1.64 2.8,16.03 2.54,16.03 2.44,15.93 v2.44,15.54 | U1.52 7.04,20.28 7.04,21.95 7.24,22.15 v7.24,22.53 | U1.21 11.18,10.48 v11.18,9.42 10.25,8.49 R2.2
  Top 0.406: LED1.A 7.29,25.4 v6.73,25.96 | v8.03,29.21 C5.1 6.83,27.49 6.37,27.03 C10.1
  Route15 0.61: v11.18,9.42 11.18,12.9 11.63,13.36 v11.63,19.91 13.56,19.91 15.24,21.59 JP9.4
  Bottom 0.203: U5.3 13.08,8.07 v13.28,8.28 | U5.5 13.73,4.15 13.83,4.04 14.43,4.04 v15.47,5.08 | C3.2 9.8,9.8 10.18,9.42 v11.18,9.42
  Bottom 0.406: U2.5 10.61,27.43 9.97,28.07 8.43,28.07 8.03,28.47 v8.03,29.21 | U3.8 v11.63,19.91 | v6.73,25.96 6.73,25.56 7.01,25.29 R1.1
  pour Route2 (isolate 0.305): 0,0 0,33.02 17.78,33.02 17.78,0
VIN
  Top 0.406: C4.1 JP9.1
  Bottom 0.406: U2.1 10.61,29.99 10.97,30.35 12.51,30.35 | 12.51,30.35 U2.3 | JP9.1 15.37,30.35 12.51,30.35

### Text on the board
Top: 1
Route2: 2
Route15: 3
Bottom: 4 | v10
tPlace: BLK | GRN | PWR | A7 | A5 | RST | RST | A6 | A4 | RESET | 13
bPlace: BLK | GRN | GND | VCC | RXI | TXO | TXO | RAW | RXI | JP5 | GND | GND | VCC | 2 | A3 | 3 | CAN485 | A2 | 4 | TXO1 | RXI1 | A1 | 5 | A0 | 6 | 13 | 7 | 12 | 8 | CAN | 485 | 11 | 9 | B | A | GND | HI | LO | 10
Measures: Units are in inches
tDocu: Atlantis-Specialist-Technologies | Revised By: Alex Wende | - 4-Layer Board!